# EAGLE design osbwifi20 (EAGLE 7.7.0)
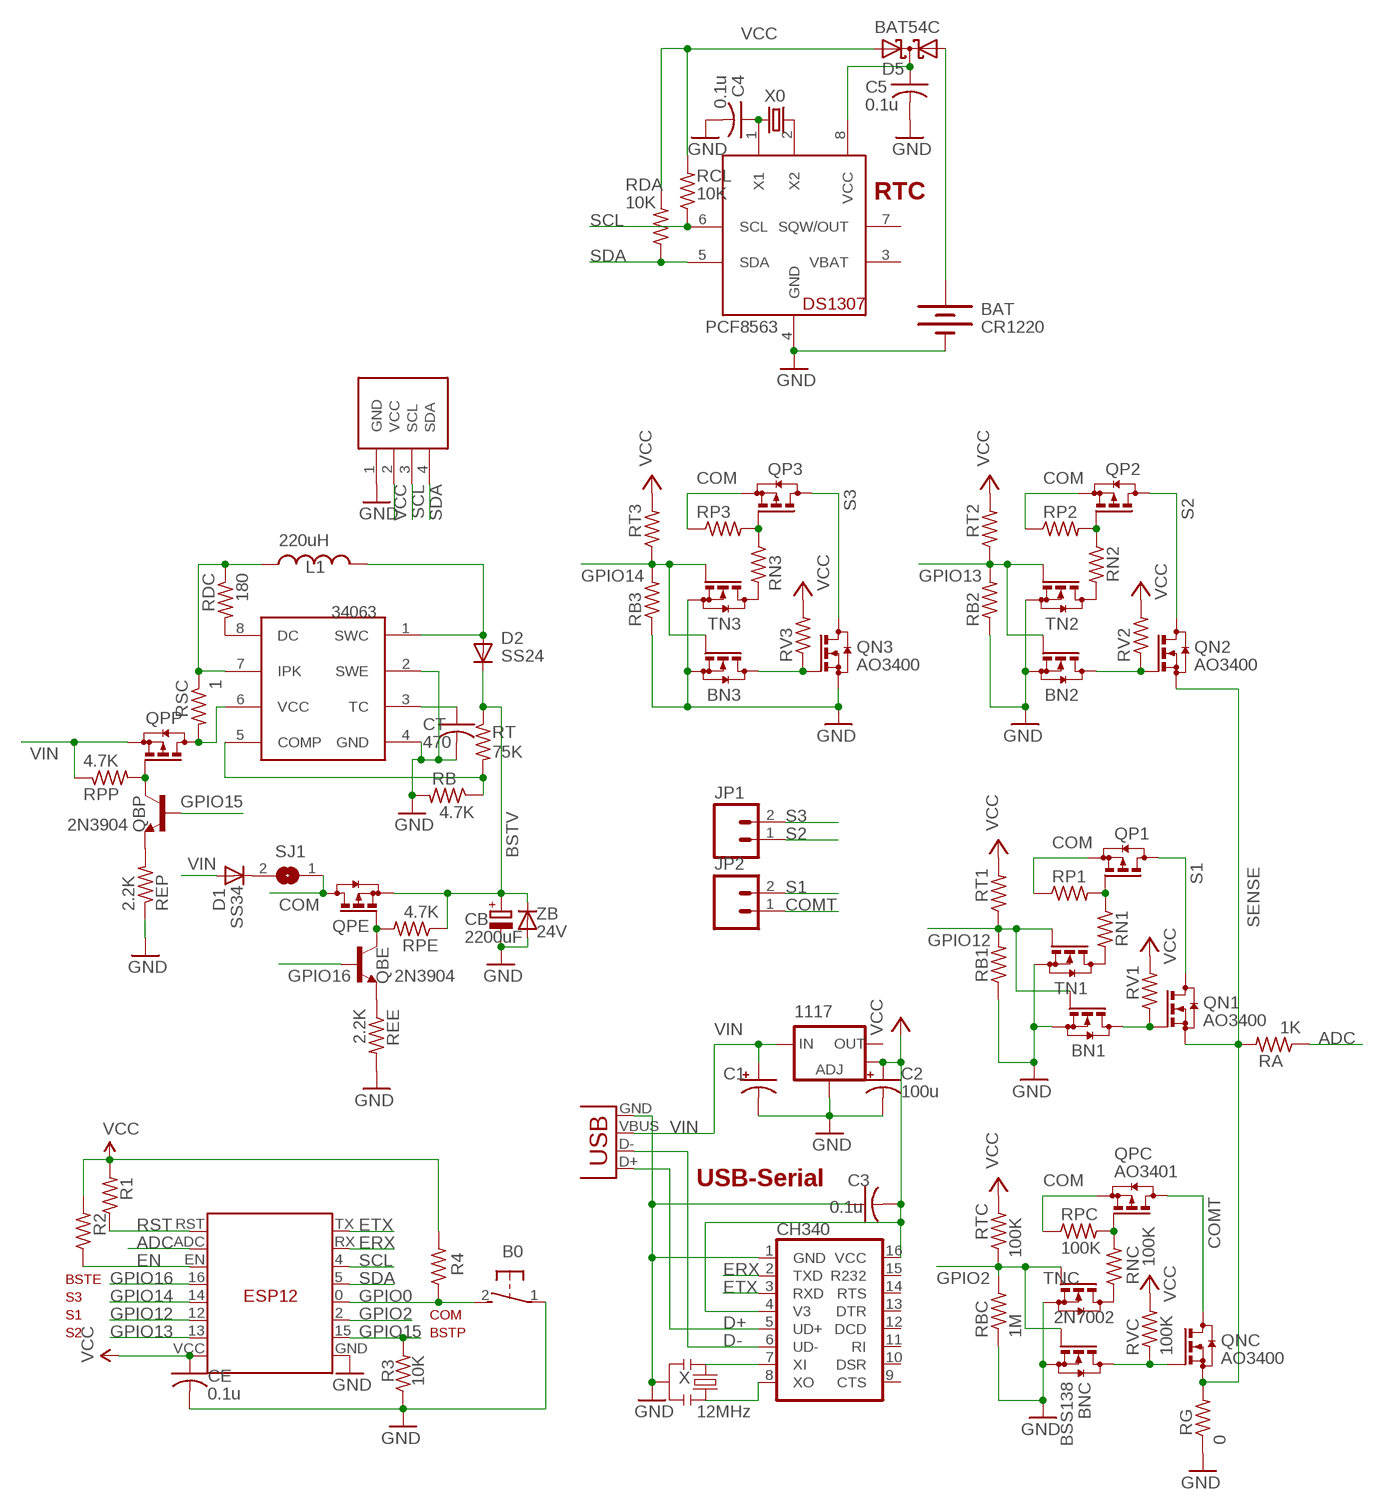
[diagram p0: schematic, sheet 1]

## Parts
1117  1117  V_REG_LM1117SOT223  [SOT223]
34063  MC33063/MC34063D  [SO08]
B0  31-XX  [B3F-31XX]
BAT  CR1220  BATTERYBATTERY_12MM_SMT  [BATTCON_12MM_SMT]
BN1  BSS138  BSS123  [SOT23]
BN2  BSS138  BSS123  [SOT23]
BN3  BSS138  BSS123  [SOT23]
BNC  BSS138  BSS123  [SOT23]
C1  100u  CPOL-USB/3528-21R  [B/3528-21R]
C2  100u  CPOL-USB/3528-21R  [B/3528-21R]
C3  0.1u  C-USC0603  [C0603]
C4  0.1u  C-USC0603  [C0603]
C5  0.1u  C-USC0603  [C0603]
CB  2200uF  CPOL-EUE5-8.5  [E5-8,5]
CE  0.1u  C-USC0603  [C0603]
CH340  CH340G  [SO16]
CT  470  C-USC0603K  [C0603K]
D1  SS34  DIODE-SMB  [SMB]
D2  SS24  DIODE-DO-214AC  [DO-214AC]
D5  BAT54C  [SOT23]
ESP  ESP  ESP12  [ESP12]
JP1  M025MM  [SCREWTERMINAL-5MM-2]
JP2  M025MM  [SCREWTERMINAL-5MM-2]
L1  220uH  INDUCTORCR54  [CR54]
PCF8563  PCF8563  DS1307SOIC  [SO08]
QBE  2N3904  TRANSISTOR_NPNSOT23-3  [SOT23-3]
QBP  2N3904  TRANSISTOR_NPNSOT23-3  [SOT23-3]
QN1  AO3400  BSS123  [SOT23]
QN2  AO3400  BSS123  [SOT23]
QN3  AO3400  BSS123  [SOT23]
QNC  AO3400  BSS123  [SOT23]
QP1  AO3407  BSS84  [SOT23]
QP2  AO3407  BSS84  [SOT23]
QP3  AO3407  BSS84  [SOT23]
QPC  AO3401  BSS84  [SOT23]
QPE  AO3401  BSS84  [SOT23]
QPP  AO3401  BSS84  [SOT23]
R1  10K  R-US_R0603  [R0603]
R2  10K  R-US_R0603  [R0603]
R3  10K  R-US_R0603  [R0603]
R4  10K  R-US_R0603  [R0603]
RA  1K  R-US_R0603  [R0603]
RB  4.7K  R-US_R0603  [R0603]
RB1  1M  R-US_R0603  [R0603]
RB2  1M  R-US_R0603  [R0603]
RB3  1M  R-US_R0603  [R0603]
RBC  1M  R-US_R0603  [R0603]
RCL  10K  R-US_R0603  [R0603]
RDA  10K  R-US_R0603  [R0603]
RDC  180  R-US_R0603  [R0603]
REE  2.2K  R-US_R0603  [R0603]
REP  2.2K  R-US_R0603  [R0603]
RG  0  R-US_R2512  [R2512]
RN1  100K  R-US_R0603  [R0603]
RN2  100K  R-US_R0603  [R0603]
RN3  100K  R-US_R0603  [R0603]
RNC  100K  R-US_R0603  [R0603]
RP1  100K  R-US_R0603  [R0603]
RP2  100K  R-US_R0603  [R0603]
RP3  100K  R-US_R0603  [R0603]
RPC  100K  R-US_R0603  [R0603]
RPE  4.7K  R-US_R0603  [R0603]
RPP  4.7K  R-US_R0603  [R0603]
RSC  1  R-US_R0603  [R0603]
RT  75K  R-US_R0603  [R0603]
RT1  100K  R-US_R0603  [R0603]
RT2  100K  R-US_R0603  [R0603]
RT3  100K  R-US_R0603  [R0603]
RTC  100K  R-US_R0603  [R0603]
RV1  100K  R-US_R0603  [R0603]
RV2  100K  R-US_R0603  [R0603]
RV3  100K  R-US_R0603  [R0603]
RVC  100K  R-US_R0603  [R0603]
SJ1  SJ  [SJ]
TN1  7002  BSS123  [SOT23]
TN2  7002  BSS123  [SOT23]
TN3  7002  BSS123  [SOT23]
TNC  2N7002  BSS123  [SOT23]
U$1  SSD1306_OLED_I2C  [SSD1306_OLED_I2C]
USB  USBSMD  [USB-MINIB]
X  12MHz  RESONATORSMD  [RESONATOR-SMD]
X0  32.768kHz  CRYSTALMM20SS1  [MM20SS1]
ZB  24V  DIODE-MINIMELF  [MINIMELF]

## Nets
ADC: ESP.ADC RA.1
BSTV [relaypower]: CB.+ D2.C QPE.2(S) RPE.1 RT.1 ZB.C
COM [relaypower]: QP1.2(S) QP2.2(S) QP3.2(S) QPC.2(S) QPE.3(D) RP1.1 RP2.1 RP3.1 RPC.1 SJ1.1
COMT [relaypower]: JP2.1 QNC.3(D) QPC.3(D)
D+: CH340.5(UD+) USB.D+
D-: CH340.6(UD-) USB.D-
EN: ESP.EN R2.1
ERX: CH340.2(TXD) ESP.RX
ETX: CH340.3(RXD) ESP.TX
GND: 1117.1(ADJ) 34063.2(SWE) 34063.4(GND) B0.1(P) BAT.P$1(-) BN1.2(S) BN2.2(S) BN3.2(S) BNC.2(S) C1.- C2.- C3.1 C4.2 C5.2 CB.- CE.2 CH340.1(GND) CT.2 ESP.GND PCF8563.4(GND) QN3.2(S) R3.1 RB1.1 RB2.1 RB3.1 RB.2 RBC.1 REE.2 REP.1 RG.1 TN1.2(S) TN2.2(S) TN3.2(S) TNC.2(S) U$1.1(GND) USB.GND X.2 ZB.A
GPIO0: B0.2(S) ESP.0(G0) R4.1
GPIO2: BNC.1(G) ESP.2(G2) RBC.2 RTC.1 TNC.1(G)
GPIO12: BN1.1(G) ESP.12(G12) RB1.2 RT1.1 TN1.1(G)
GPIO13: BN2.1(G) ESP.13(G13) RB2.2 RT2.1 TN2.1(G)
GPIO14: BN3.1(G) ESP.14(G14) RB3.2 RT3.1 TN3.1(G)
GPIO15: ESP.15(G15) QBP.1(B) R3.2
GPIO16: ESP.16(G16) QBE.1(B)
N$1: QPC.1(G) RNC.2 RPC.2
N$2: QBP.3(C) QPP.1(G) RPP.2
N$3: RNC.1 TNC.3(D)
N$4: RN1.2 TN1.3(D)
N$5: BNC.3(D) QNC.1(G) RVC.1
N$6: CH340.7(XI) X.1
N$7: QP1.1(G) RN1.1 RP1.2
N$8: RN3.2 TN3.3(D)
N$9 [relaypower]: 34063.1(SWC) D2.A L1.P$2
N$10: D1.C SJ1.2
N$11: BN1.3(D) QN1.1(G) RV1.1
N$12: QP2.1(G) RN2.1 RP2.2
N$13: RN2.2 TN2.3(D)
N$14: C4.1 PCF8563.1(X1) X0.1
N$15: BN2.3(D) QN2.1(G) RV2.1
N$16: QP3.1(G) RN3.1 RP3.2
N$17: BAT.P$2(+) D5.1(A1)
N$19: BN3.3(D) QN3.1(G) RV3.1
N$21: QBE.2(E) REE.1
N$26 [relaypower]: 34063.7(IPK) L1.P$1 RDC.1 RSC.1
N$27 [power]: 34063.6(VCC) QPP.3(D) RSC.2
N$28: 34063.3(TC) CT.1
N$29: 34063.5(COMP) RB.1 RT.2
N$30: PCF8563.2(X2) X0.4
N$31: 34063.8(DC) RDC.2
N$32: QBP.2(E) REP.2
N$38: QBE.3(C) QPE.1(G) RPE.2
N$40: CH340.8(XO) X.3
N$51: C5.1 D5.3(CC) PCF8563.8(VCC)
RST: ESP.RST R1.1
S1 [relaypower]: JP2.2 QN1.3(D) QP1.3(D)
S2 [relaypower]: JP1.1 QN2.3(D) QP2.3(D)
S3 [relaypower]: JP1.2 QN3.3(D) QP3.3(D)
SCL: ESP.4(G4) PCF8563.6(SCL) RCL.1 U$1.3(SCL)
SDA: ESP.5(G5) PCF8563.5(SDA) RDA.1 U$1.4(SDA)
SENSE [relaypower]: QN1.2(S) QN2.2(S) QNC.2(S) RA.2 RG.2
VCC: 1117.4(OUT) C2.+ C3.2 CE.1 CH340.4(V3) CH340.16(VCC) D5.2(A2) ESP.VCC R1.2 R2.2 R4.2 RCL.2 RDA.2 RT1.2 RT2.2 RT3.2 RTC.2 RV1.2 RV2.2 RV3.2 RVC.2 U$1.2(VCC)
VIN [power]: 1117.3(IN) C1.+ D1.A QPP.2(S) RPP.1 USB.VBUS
Unconnected: 1117.2(OUT) CH340.9(CTS) CH340.10(DSR) CH340.11(RI) CH340.12(DCD) CH340.13(DTR) CH340.14(RTS) CH340.15(R232) PCF8563.7(SQW/OUT)

## Notes on the sheet
- RTC
- USB-Serial
- BSTE
- S3
- S1 | COM
- S2 | BSTP

## Power pins joined to a net without a drawn wire
VBAT: PCF8563.3(VBAT)

## Library data of the parts
1117 = SparkFun:V_REG_LM1117: Voltage Regulator LM1117 Standard adjustable voltage regulator but in SMD form. Spark Fun Electronics SKU : COM-00595
34063 = adafruit:MC33063/MC34063: MC33063 and MC34063 Basic DC/DC converter with internal power-NPN transistor, 100KHz, 1.5A peak switch current. 3-40 input/output.
B0 = switch-omron:31-XX: OMRON SWITCH; MPN: B3F-3100; OC_FARNELL: 959704; OC_NEWARK: 36M3582
BAT = SparkFunNew:BATTERY: Battery Holders Various common sizes : AA, AAA, 20mm coin cell and 12mm coin cell.
BN1-BN3 BNC QN1-QN3 QNC TN1-TN3 TNC = transistor-small-signal:BSS123: N-CHANNEL MOS FET
C1 C2 = adafruit_3:CPOL-US: POLARIZED CAPACITOR, American symbol
C3-C5 CE CT = adafruit:C-US: CAPACITOR, American symbol
CB = rcl:CPOL-EU: POLARIZED CAPACITOR, European symbol
CH340 = SparkFunNew:CH340
D1 D2 ZB = diode:DIODE-: DIODE
D5 = diode:BAT54C: Schottky Diodes Source: Fairchild .. BAT54.pdf
ESP = JeeParts:ESP12
JP1 JP2 = SparkFun:M02: Header 2 Standard 2-pin 0.1" header. Use with straight break away headers (SKU : PRT-00116), right angle break away headers (PRT-00553), swiss pins (PRT-00743), machine pins (PRT-00117), and female headers (PRT-00115). Molex polarized connector foot print use with SKU : PRT-08233 with associated crimp pins and housings.
L1 = SparkFunNew:INDUCTOR: Inductors Basic Inductor/Choke - 0603 and 1206. Footprints are not proven and vary greatly between part numbers.
PCF8563 = adafruit:DS1307: DS1307 Real time clock (RTC) with battery backup ability. Talk to it via i2c
QBE QBP = SparkFunNew:TRANSISTOR_NPN: Transistor NPN BJT configuration in SOT23 package. MMBT2222 is the common NPN we use. Double check BCE configuration again layout.
QP1-QP3 QPC QPE QPP = transistor-small-signal:BSS84: P-CHANNEL MOS FET
R1 R2 R4 = adafruit:R-US_: RESISTOR, American symbol
R3 RCL RDA RG = adafruit2013:R-US_: RESISTOR, American symbol
RA RB RB1-RB3 RBC RDC REE REP RN1-RN3 RNC RP1-RP3 RPC RPE RPP RSC RT RT1-RT3 RTC RV1-RV3 RVC = adafruitGood:R-US_: RESISTOR, American symbol
SJ1 = jumper:SJ: SMD solder JUMPER
U$1 = adafruit2013:SSD1306_OLED_I2C
USB = SparkFunNew:USB: USB Connectors USB-B-PTH is fully proven SKU : PRT-00139 USB-miniB is fully proven SKU : PRT-00587 USB-A-PCB is untested. USB-A-H is throughly reviewed, but untested. Spark Fun Electronics SKU : PRT-00437 USB-B-SMT is throughly reviewed, but untested. Needs silkscreen touching up. USB-A-S has not been used/tested USB-MB-H has not been used/tested
X = SparkFunNew:RESONATOR: Resonator Small SMD resonator. This is the itty bitty 10/20MHz resonators with built in caps. CSTCE10M0G55 and CSTCE20M0V53. Footprint has been reviewed closely but hasn't been tested yet.
X0 = crystal:CRYSTAL: CRYSTAL

## Net classes
0 default: width 0.203 mm, clearance 0.178 mm
1 power: width 0.305 mm, clearance 0.178 mm
2 relaypower: width 0.508 mm, clearance 0.305 mm

## Board
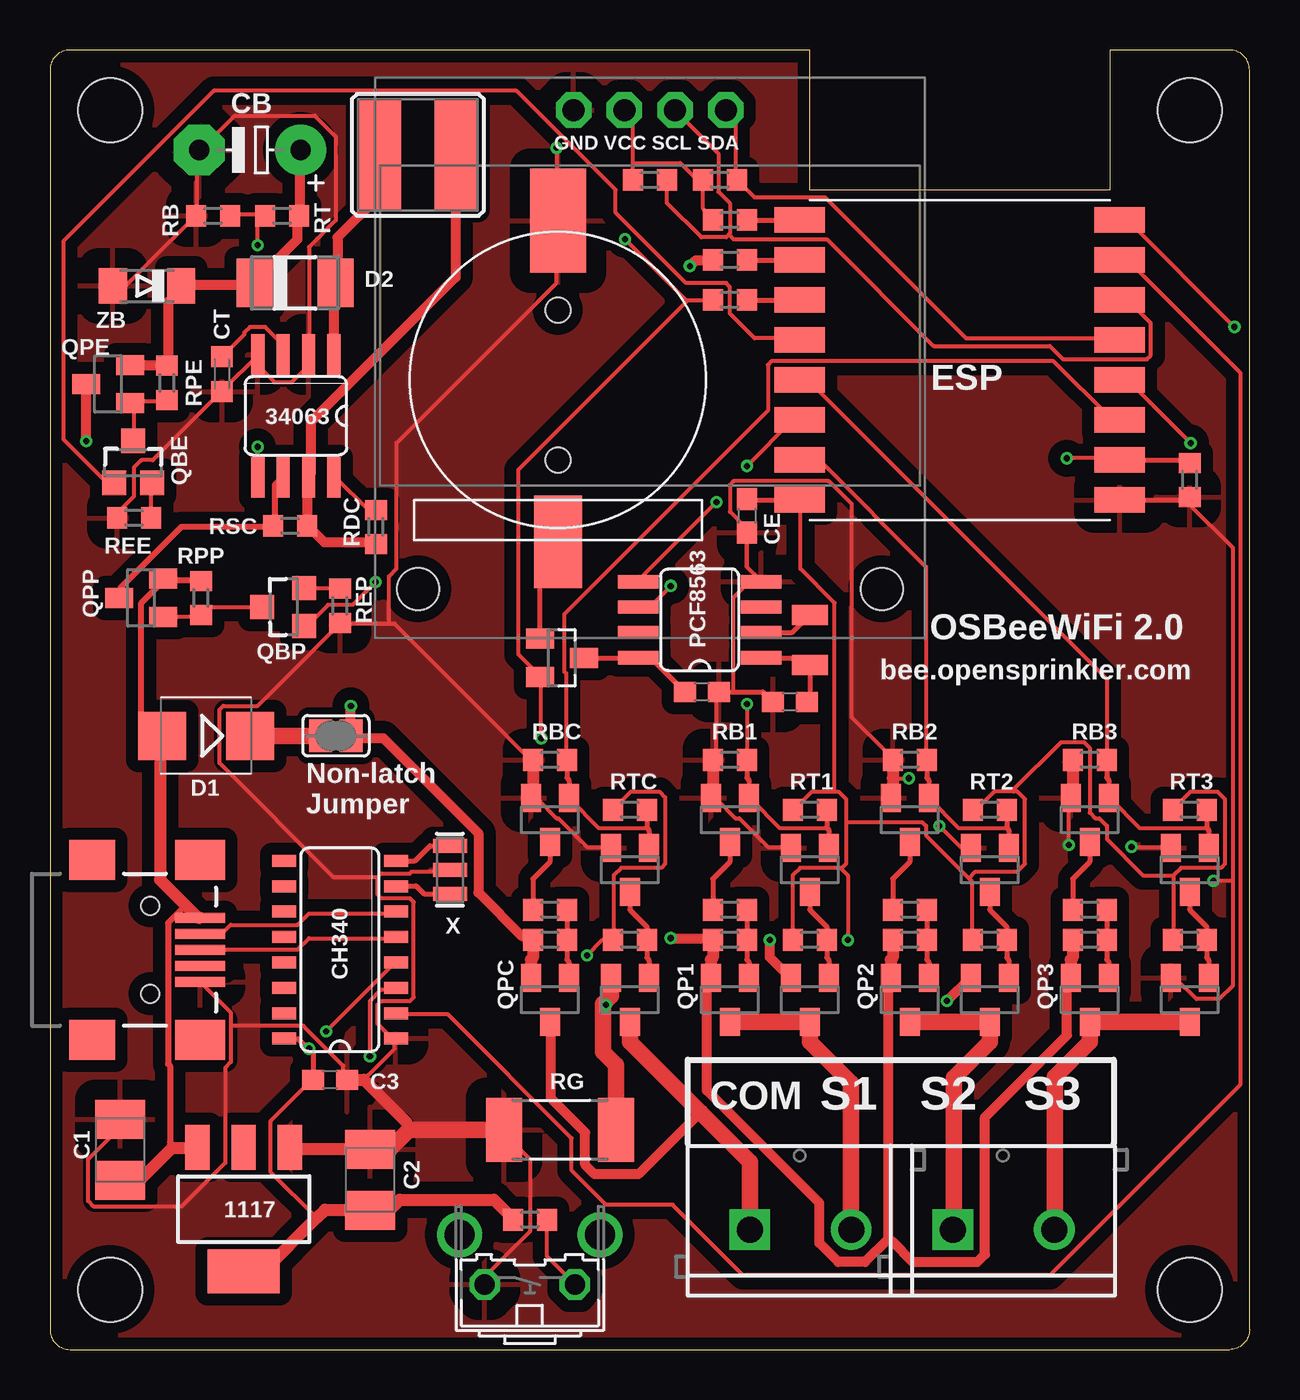
[diagram p1: board, top side]
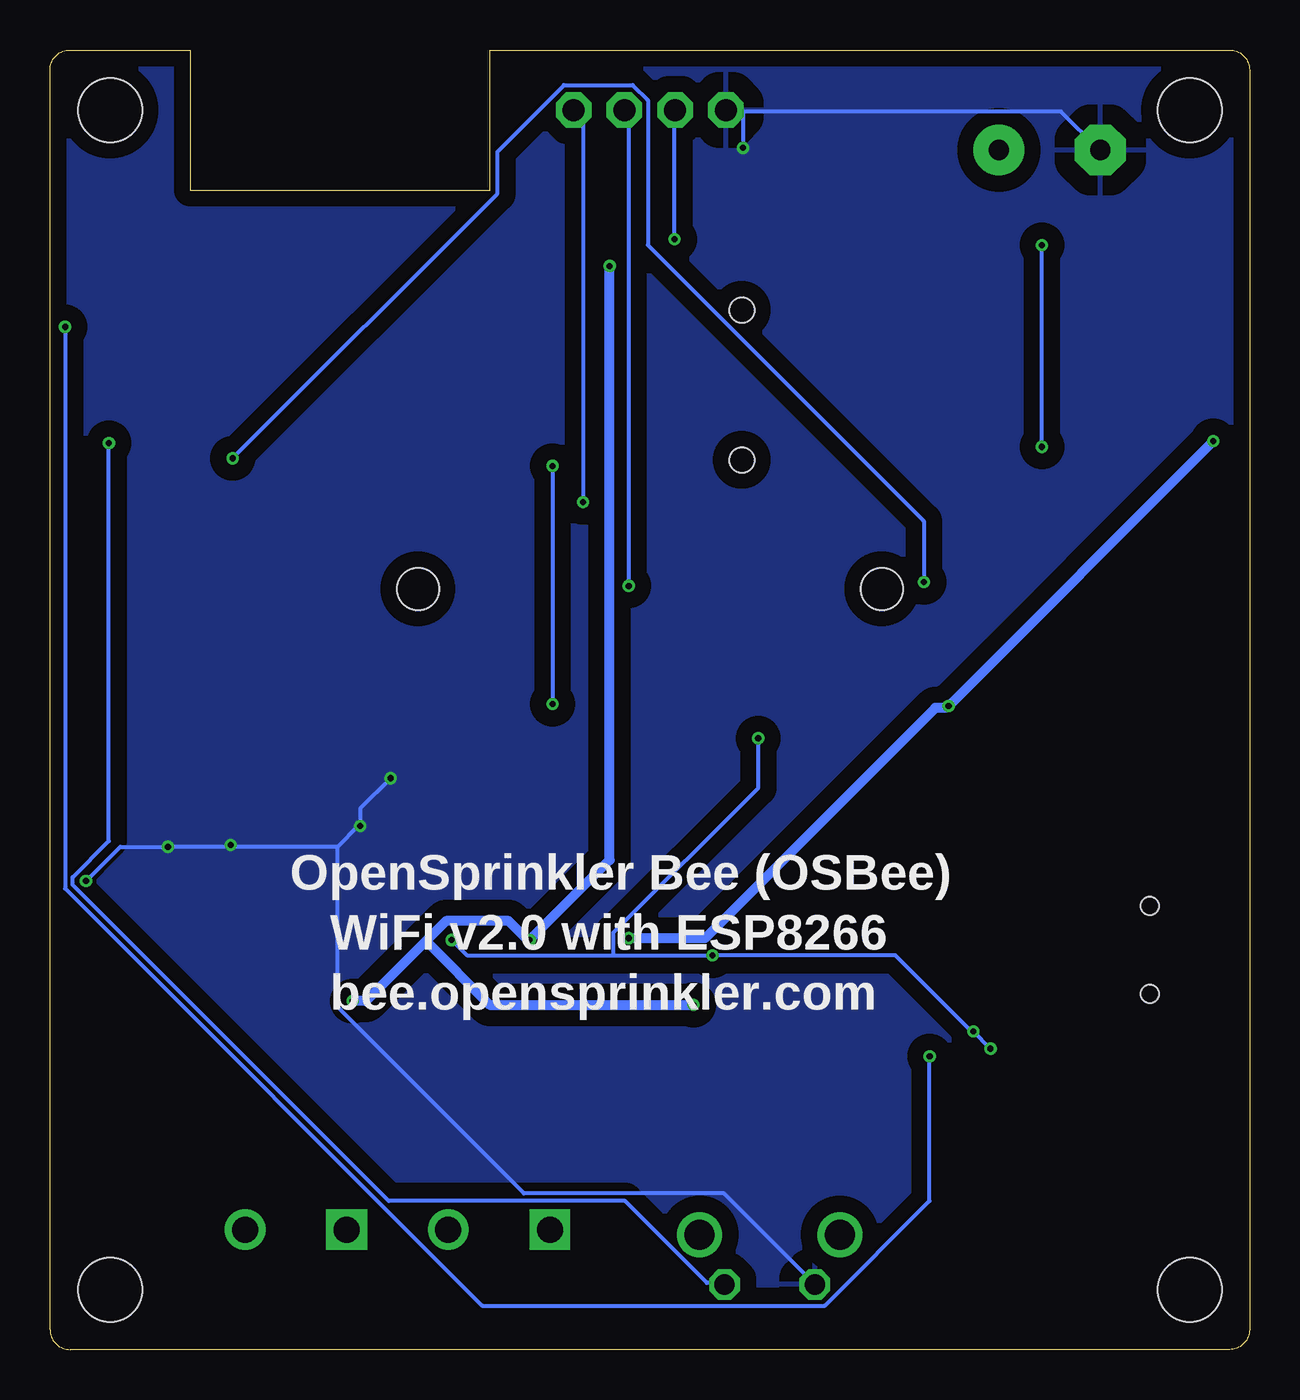
[diagram p2: board, bottom side, seen from below]

Size 60 x 65 mm. Coordinates in mm from the lower left corner, seen from the top.
Outline: 1,0 59,0 arc90 60,1 60,64 arc90 59,65 53,65 53,58 38,58 38,65 1,65 arc90 0,64 0,1 arc90 1,0
Copper layers (1*16): Top 0.035mm / dielectric 1.5mm / Bottom 0.035mm
Design rules "Fusion_eagle_rule_v1.1 *": minimum track width 6mil, minimum drill 12mil, track to track 6mil, track to pad 6mil, pad to pad 6mil, via to via 6mil, smd to smd 0mil, copper to edge 10mil, drill to drill 10mil, minimum pad ring 10mil, minimum via ring 6mil, stop-mask expansion 2mil, vias tented up to drill 100mil, thermal gap 40mil
Holes 3.2 mm at 3,3 57,3 3,62 57,62
bRestrict: area 4,17 to 9,23

### Footprints (pad centres in the part's own frame; a part is rotated, then mirrored left to right if it is on the bottom)
SOT223 = smd 1.219 x 2.235: 1 -2.311,-3.099; 2 0,-3.099; 3 2.311,-3.099 | smd 3.6 x 2.2: 4 0,3.099
SO08 = smd 0.66 x 2.032: 1 -1.905,-3.073; 2 -0.635,-3.073; 3 0.635,-3.073; 4 1.905,-3.073; 5 1.905,3.073; 6 0.635,3.073; 7 -0.635,3.073; 8 -1.905,3.073
B3F-31XX = drill 1.016 octagon: 1 -2.261,-1.245; 2 2.261,-1.245 | drill 1.499 pad 2.159: 3 -3.505,1.245; 4 3.505,1.245
BATTCON_12MM_SMT = smd 2.8 x 5.2: P$1 0,11.96 | smd 2.4 x 4.6: P$2 0,-4.1 | hole 1.25: 0,7.5; 0,0
SOT23 = smd 1 x 1.4: 1 -0.95,-1.1; 2 0.95,-1.1; 3 0,1.1
B/3528-21R = smd 1.95 x 2.5: + 1.525,0; - -1.525,0
C0603 = smd 1.1 x 1: 1 -0.85,0; 2 0.85,0
E5-8,5 = drill 1.016 pad 2.54: + -2.54,0 | drill 1.016 pad 2.54 octagon: - 2.54,0
SO16 = smd 0.6 x 1.2: 1 -4.445,-2.8; 2 -3.175,-2.8; 3 -1.905,-2.8; 4 -0.635,-2.8; 5 0.635,-2.8; 6 1.905,-2.8; 7 3.175,-2.8; 8 4.445,-2.8; 9 4.445,2.8; 10 3.175,2.8; 11 1.905,2.8; 12 0.635,2.8; 13 -0.635,2.8; 14 -1.905,2.8; 15 -3.175,2.8; 16 -4.445,2.8
C0603K = smd 1.05 x 1.08: 1 -0.875,0; 2 0.875,0
SMB = smd 2.4 x 2.4: A 2.2,0; C -2.2,0
DO-214AC = smd 1.8 x 2.4: A 2.025,0; C -2.025,0
ESP12 = smd 2.54 x 1.27: 0 8,-2; 2 8,-4; 4 8,2; 5 8,0; 12 -8,-4; 13 -8,-6; 14 -8,-2; 15 8,-6; 16 -8,0; ADC -8,4; EN -8,2; GND 8,-8; RST -8,6; RX 8,4; TX 8,6; VCC -8,-8
SCREWTERMINAL-5MM-2 = drill 1.3 pad 2.032 square: 1 0,0 | drill 1.3 pad 2.032: 2 5.08,0
CR54 = smd 5.5 x 2.15: P$1 0,1.92; P$2 0,-1.92
SOT23-3 = smd 1.2 x 1.2: 1 -0.95,-1; 2 0.95,-1; 3 0,1.1
R0603 = smd 1 x 1.1: 1 -0.85,0; 2 0.85,0
R2512 = smd 1.8 x 3.2: 1 -2.8,0; 2 2.8,0
SJ = smd 1.168 x 1.6: 1 -0.762,0; 2 0.762,0
SSD1306_OLED_I2C = drill 1.1 pad 1.778 octagon: 1 -3.81,0; 2 -1.27,0; 3 1.27,0; 4 3.81,0 | hole 2.1: 11.6,-23.95; -11.6,-23.95
USB-MINIB = smd 2.5 x 0.5: D+ 2.5,0; D- 2.5,0.8; GND 2.5,-1.6; ID 2.5,-0.8; VBUS 2.5,1.6 | smd 2.3 x 2: MTN1 -2.9,4.5; MTN3 -2.9,-4.5 | smd 2.5 x 2: MTN2 2.5,4.5; MTN4 2.5,-4.5 | hole 0.9: 0,2.2; 0,-2.2
RESONATOR-SMD = smd 0.7 x 1.7: 1 -1.2,0; 2 0,0; 3 1.2,0
MM20SS1 = smd 1.8 x 1: 1 0,-1.25; 4 0,1.25
MINIMELF = smd 1.4 x 1.8: A 1.7,0; C -1.7,0

### Placement (x,y rotation side)
1117  9.69,7.01 180 top
34063  12.3,46.7 180 top
B0  24,4.5 0 top
BAT  25.4,44.5 0 top
BN1  38,24 180 top
BN2  47,24 180 top
BN3  57,24 180 top
BNC  29,24 180 top
C1  3.5,10 270 top
C2  16,8.5 270 top
C3  14,13.5 180 top
C4  37,32.4 180 top
C5  32.6,32.9 0 top
CB  10,60 180 top
CE  34.85,41.7 270 top
CH340  14.5,20 90 top
CT  8.6,48.8 270 top
D1  7.8,30.7 180 top
D2  12.25,53.35 0 top
D5  25.6,34.6 270 top
ESP  45.5,50.5 0 top
JP1  45.16,6 0 top
JP2  35,6 0 top
L1  18.4,59.75 270 top
PCF8563  32.5,36.5 90 top
QBE  4.15,44.35 0 top
QBP  11.7,37.15 90 top
QN1  38,17.5 180 top
QN2  47,17.5 180 top
QN3  57,17.5 180 top
QNC  29,17.5 180 top
QP1  34,17.5 180 top
QP2  43,17.5 180 top
QP3  52,17.5 180 top
QPC  25,17.5 180 top
QPE  2.9,48.3 90 top
QPP  4.55,37.6 90 top
R1  34,56.5 180 top
R2  34,52.5 180 top
R3  57,43.5 90 top
R4  24,6.5 180 top
RA  34,54.5 180 top
RB  8.15,56.7 180 top
RB1  34,29.5 0 top
RB2  43,29.5 0 top
RB3  52,29.5 0 top
RBC  25,29.5 0 top
RCL  30,58.5 180 top
RDA  33.5,58.5 180 top
RDC  16.3,41.15 90 top
REE  4.2,41.6 180 top
REP  14.5,37.2 90 top
RG  25.5,11 0 top
RN1  34,22 180 top
RN2  43,22 180 top
RN3  52,22 180 top
RNC  25,22 0 top
RP1  34,20.5 0 top
RP2  43,20.5 0 top
RP3  52,20.5 0 top
RPC  25,20.5 0 top
RPE  5.85,48.35 270 top
RPP  7.55,37.6 270 top
RSC  12,41.2 180 top
RT  11.6,56.7 180 top
RT1  38,27 180 top
RT2  47,27 180 top
RT3  57,27 180 top
RTC  29,27 180 top
RV1  38,20.5 180 top
RV2  47,20.5 180 top
RV3  57,20.5 180 top
RVC  29,20.5 180 top
SJ1  14.3,30.7 180 top
TN1  34,26.5 180 top
TN2  43,26.5 180 top
TN3  52,26.5 180 top
TNC  25,26.5 180 top
U$1  30,62 0 top
USB  5,20 0 top
X  20,24 90 top
X0  38,35.5 0 top
ZB  4.85,53.2 180 top

### Tracks (layer width: path | path; a pad name or v marks a point on that pad's centre or on a via)
ADC
  Top 0.254: ESP.ADC 35,54.5 34.9,54.6 34.8,54.5 RA.1
BSTV
  Top 0.508: CB.+ 12.48,59.91 12.48,56.77 RT.1 12.38,56.48 12.38,55.53 10.38,53.53 D2.C 10.19,53.34 10.1,53.24 6.57,53.24 ZB.C 6.48,52.96 5.91,52.39 5.91,49.44 RPE.1 5.81,49.24 QPE.2
COM  (via drill 0.3)
  Top 0.508: 41.91,5.52 40.77,4.38 39.43,4.38 38.48,5.33 38.48,7.33 32.86,12.95 32.86,18.38 QP1.2 | 41.91,5.52 41.91,18.38 QP2.2 | QP3.2 50.86,18.38 50.86,15.72 46.77,11.62 46.77,4.76 46.39,4.38 43.15,4.38 42.1,5.43 41.91,5.52 | v1.81,45.43 QPE.3 | v15.05,32.19 15.05,30.77 SJ1.1 15.24,30.57 16.67,30.57 21.43,25.81 21.43,22.86 23.62,20.67 23.91,20.67 RPC.1 | v31.05,20.57 32.86,20.57 RP1.1
  Top 0.61: QPC.2 24.05,19.5 24.15,19.6 RPC.1 | QP1.2 33.05,19.5 33.15,19.6 RP1.1 | QP2.2 42.05,19.5 42.15,19.6 RP2.1 | QP3.2 51.05,19.5 51.15,19.6 RP3.1
  Bottom 0.508: v1.81,45.43 v15.05,32.19 15.24,32.1 15.72,32.1 27.24,20.57 v31.05,20.57
COMT
  Top 0.508: 32.53,11.87 29.43,8.76 27.24,8.76 26.77,9.24 26.77,10.86 25.05,12.57 25.05,16.38 QPC.3
  Top 0.813: JP2.1 35,9.4 32.53,11.87 29,15.4 QNC.3
D+
  Top 0.203: CH340.5 17.24,20.57 12.95,20.57 12.38,20 7.53,20 USB.D+
D-
  Top 0.203: CH340.6 17.24,21.81 12.95,21.81 12.38,21.24 9.05,21.24 8.67,20.86 7.53,20.86 USB.D-
EN
  Top 0.254: ESP.EN 35,52.5 34.9,52.6 34.8,52.5 R2.1
ERX
  Top 0.203: CH340.2 17.34,16.76 19.91,16.76 26.1,10.57 26.1,8.95 27.81,7.24 31.15,7.24 34.67,3.71 50.01,3.71 59.53,13.24 59.53,48.86 53.91,54.48 53.53,54.48 ESP.RX
ETX  (via drill 0.3)
  Top 0.203: v16,14.67 16,17.43 16.57,18 17.24,18 CH340.3 | v59.24,51.15 53.91,56.48 53.53,56.48 ESP.TX
  Bottom 0.203: v16,14.67 16,7.43 21.24,2.19 38.39,2.19 59.24,23.05 v59.24,51.15
GND  (via drill 0.3)
  Top 0.203: BN1.2 36.96,25.15 35.91,25.15 34.48,26.57 34.29,26.57 33.34,27.53 TN1.2 | C5.2 33.34,32.86 33.34,29.72 RB1.1 | 34.2,32.9 34.2,37.62 35.24,38.67 PCF8563.4 35.53,38.48 34.86,39.15 34.86,40.77 CE.2 34.77,40.86 34.77,41.15 34,41.91 34,43.24 34.2,43.43 38.96,43.43 40.1,42.29 40.1,31.62 42.01,29.72 RB2.1 | v44.48,26.19 45.53,25.15 46.01,25.15 BN2.2 | 42.15,28.57 v42.96,28.57 | v54.1,25.15 56.01,25.15 BN3.2 | v50.96,25.24 50.96,27.34 TN3.2 | 59.15,23.43 59.15,40.1 56.86,42.39 R3.1 | 59.15,23.43 59.15,18.19 58.48,17.53 57.34,17.53 56.29,18.57 56.1,18.57 QN3.2 | 59.15,23.43 v58.2,23.43 | REE.2 3.43,41.62 3.43,41.91 4.19,42.67 4.19,44.1 4.57,44.48 5.14,44.48 8.57,47.91 CT.2 8.67,48.01 10.38,49.72 34063.4 10.19,49.44 11.24,48.39 12.1,48.39 12.86,49.15 12.86,49.72 34063.2 12.95,49.82 12.95,55.15 14.29,56.48 14.29,60.67 13.24,61.72 9.24,61.72 7.53,60.01 CB.- 7.43,59.91 7.33,59.82 7.33,56.77 RB.2 7.24,56.67 3.81,53.24 3.24,53.24 ZB.A | v25.34,60.1 25.34,56.48 BAT.P$1 25.34,56.39 25.34,53.34 17.34,45.34 17.34,39.05 16.95,38.67 16.95,36.29 | 16.95,36.29 17.24,36.29 23.91,29.62 RBC.1 | 16.95,36.29 14.57,36.29 REP.1 14.48,36.29 10.38,32.19 8.67,32.19 8.48,32 8.48,29.34 14.19,23.62 16.38,23.62 | BNC.2 28,25.15 26.86,25.15 25.43,26.57 25.34,26.57 24.38,27.53 TNC.2 | 9.05,16.19 9.05,16.86 7.53,18.38 USB.GND | 9.05,16.19 9.05,14.38 8.76,14.1 8.76,9.34 6.57,7.14 2.19,7.14 1.91,7.43 1.91,9.53 3.43,11.05 3.43,11.43 C1.- | 17.34,15.62 CH340.1 | CH340.1 17.24,15.53 17.24,15.05 15.91,13.72 15.7,13.5 | 16.38,23.62 16.57,23.81 18,23.81 18.1,23.91 19.91,23.91 X.2
  Top 0.203: 16.38,23.62 16.38,22.77 16.57,22.57 18,22.57 18.19,22.38 18.19,17.62 18,17.43 16.57,17.43 16.38,17.24 16.38,16.29 17.14,15.53 CH340.1 | B0.1 21.81,3.33 21.81,3.71 24,5.91 24,9.53 22.86,10.67 RG.1 | 9.05,16.19 12.67,16.19 14.67,14.19 14.67,13.72 C3.1
  Top 0.254: ESP.GND 56.85,42.5 R3.1 | C5.2 34.2,32.9 35.65,32.9 C4.2
  Top 0.61: RBC.1 24.15,27.7 TNC.2 | RB1.1 33.15,27.7 TN1.2 | RB2.1 42.15,28.57 42.15,27.7 TN2.2 | RB3.1 51.15,27.7 TN3.2 | C2.- 16,10.05 12,10.05 1117.1 | C3.1 15.7,13.5 17.8,11.4 17.95,11
  Top 0.813: RG.1 17.95,11 17,10.05 16.3,10.05 C2.-
  Bottom 0.203: v42.96,28.57 44.48,27.05 v44.48,26.19 44.58,26.19 45.62,25.15 | 45.62,25.15 50.96,25.15 | 50.96,25.15 v54.1,25.15 56.48,25.15 v58.2,23.43 | v50.96,25.24 50.96,25.15 | CB.- 7.53,60.01 9.43,61.91 26.1,61.91 U$1.1 25.34,61.82 v25.34,60.1 | 45.62,25.15 45.62,17.14 36.29,7.81 26.29,7.81 21.81,3.33 B0.1
  pour Top (isolate 0.61): 0,65 60,65 60,0 0,0
  pour Bottom (isolate 0.813): 0,65 60,65 60,0 0,0
GPIO0  (via drill 0.3)
  Top 0.203: R4.1 24.86,6.48 24.86,4.67 26.19,3.33 B0.2 | v57.05,45.34 53.91,48.48 53.53,48.48 ESP.0
  Bottom 0.203: v57.05,45.34 57.05,25.43 58.86,23.62 58.86,23.24 43.05,7.43 31.24,7.43 27.15,3.33 26.29,3.33 B0.2
GPIO2
  Top 0.203: 29.85,26.1 29.81,26.1 27.43,26.1 26,27.53 TNC.1 | RBC.2 25.81,29.62 25.81,33.81 25.72,33.91 25.72,36.77 35.91,46.96 35.91,49.24 36.1,49.44 50.2,49.44 53.05,46.58 53.44,46.58 ESP.2
  Top 0.254: BNC.1 29.95,26 29.85,26.1 RTC.1 | TNC.1 25.95,28.5 25.85,28.6 RBC.2
GPIO12  (via drill 0.3)
  Top 0.203: 38.85,26.1 38.77,26.1 36.48,26.1 35.05,27.53 TN1.1 | v34.86,32.29 34.86,29.62 RB1.2 | v34.86,44.2 37.15,46.48 37.43,46.48 ESP.12
  Top 0.254: BN1.1 38.95,26 38.85,26.1 RT1.1 | TN1.1 34.95,28.5 34.85,28.6 RB1.2
  Bottom 0.203: v34.86,44.2 v34.86,32.29
GPIO13
  Top 0.203: 47.85,26.1 47.82,26.1 45.43,26.1 44.01,27.53 TN2.1 | RB2.2 43.81,29.62 43.81,39.15 38.48,44.48 37.53,44.48 ESP.13
  Top 0.254: BN2.1 47.95,26 47.85,26.1 RT2.1 | TN2.1 43.95,28.5 43.85,28.6 RB2.2
GPIO14
  Top 0.203: 57.85,26.1 57.82,26.1 54.48,26.1 53.05,27.53 TN3.1 | RB3.2 52.86,29.62 52.86,33.53 37.91,48.48 37.53,48.48 ESP.14
  Top 0.254: BN3.1 57.95,26 57.85,26.1 RT3.1 | TN3.1 52.95,28.5 52.85,28.6 RB3.2
GPIO15  (via drill 0.3)
  Top 0.203: v16.29,38.39 15.14,37.24 13.91,37.24 12.95,36.29 12.76,36.29 QBP.1 | v50.86,44.58 53.44,44.58 ESP.15
  Top 0.254: ESP.15 56.85,44.5 R3.2
  Bottom 0.203: v16.29,38.39 16.29,41.43 30.1,55.24 30.1,62.48 30.86,63.25 34.29,63.25 37.62,59.91 37.62,57.82 v50.86,44.58
GPIO16
  Top 0.203: QBE.1 3.14,43.43 2.76,43.43 0.67,45.53 0.67,55.44 8.19,62.96 23.34,62.96 28.29,58.01 28.29,56.86 31.81,53.34 33.81,53.34 34,53.15 34,51.82 35.24,50.58 37.43,50.58 ESP.16
N$1
  Top 0.254: QPC.1 25.95,19.4 25.85,19.5 RPC.2 RNC.2
N$2
  Top 0.203: 7.62,36.77 RPP.2 | RPP.2 7.53,36.67 5.71,36.67 QPP.1 | QBP.3 10.57,37.15 8.1,37.15 7.71,36.77 RPP.2
N$3
  Top 0.254: RNC.1 24.15,23.55 25,24.4 TNC.3
N$4
  Top 0.254: RN1.2 33.15,23.55 34,24.4 TN1.3
N$5
  Top 0.254: QNC.1 29.95,19.5 29.85,19.6 RVC.1 29.85,21.15 29,22 BNC.3
N$6
  Top 0.254: X.1 18.7,22.8 18.3,23.2 17.3,23.2 CH340.7
N$7
  Top 0.254: RN1.1 RP1.2 34.85,19.5 34.95,19.4 QP1.1
N$8
  Top 0.254: RN3.2 51.15,23.55 52,24.4 TN3.3
N$9
  Top 0.508: 34063.1 14.19,49.82 14.19,53.34 D2.A 14.38,53.53 14.38,55.63 16.48,57.72 16.48,59.72 L1.P$2
N$10
  Top 0.813: D1.C SJ1.2
N$11
  Top 0.254: BN1.3 38,22 38.85,21.15 RV1.1 38.85,19.6 38.95,19.5 QN1.1
N$12
  Top 0.254: RN2.1 RP2.2 43.85,19.5 43.95,19.4 QP2.1
N$13
  Top 0.254: RN2.2 42.15,23.55 43,24.4 TN2.3
N$14
  Top 0.254: PCF8563.1 37.66,34.59 X0.1 38,32.55 C4.1
N$15
  Top 0.254: BN2.3 47,22 47.85,21.15 RV2.1 47.85,19.6 47.95,19.5 QN2.1
N$16
  Top 0.254: RN3.1 RP3.2 52.85,19.5 52.95,19.4 QP3.1
N$17
  Top 0.254: D5.1 24.5,39.5 BAT.P$2
N$19
  Top 0.254: BN3.3 57,22 57.85,21.15 RV3.1 57.85,19.6 57.95,19.5 QN3.1
N$21
  Top 0.203: REE.1 5.05,41.62 5.05,43.34 QBE.2
N$26
  Top 0.508: RDC.1 16.29,40.39 13.72,40.39 13.05,41.05 RSC.1 12.86,41.24 12.86,43.62 34063.7 13.05,43.81 13.05,46.39 20.29,53.63 20.29,59.72 L1.P$1
N$27
  Top 0.305: 34063.6 11.62,43.62 11.24,43.24 11.24,41.24 RSC.2 11.05,41.15 6.57,41.15 3.52,38.1 3.52,37.62 QPP.3
N$28
  Top 0.203: CT.1 8.67,49.72 9.72,50.77 9.72,50.86 10,51.15 10.76,51.15 11.62,50.29 11.62,49.82 34063.3
N$29  (via drill 0.3)
  Top 0.203: RB.1 9.05,56.77 10.67,56.77 RT.2 10.38,56.67 v10.38,55.24 | v10.38,45.15 10.38,43.72 34063.5
  Bottom 0.203: v10.38,45.15 v10.38,55.24
N$30
  Top 0.254: PCF8563.2 37.12,35.87 X0.4
N$31
  Top 0.203: RDC.2 16.29,42.01 15.91,42.01 14.29,43.62 34063.8
N$32
  Top 0.203: QBP.2 14.48,38.1 REP.2
N$38
  Top 0.203: 5.91,47.53 RPE.2 5.81,47.43 4,47.43 QPE.1 4.19,47.34 4.19,45.53 QBE.3
N$40
  Top 0.254: X.3 19,25.2 18.25,24.45 CH340.8
N$51
  Top 0.254: D5.3 PCF8563.8 30.05,34.59 C5.1
RST
  Top 0.254: ESP.RST 35,56.5 34.9,56.6 34.8,56.5 R1.1
S1
  Top 0.813: QP1.3 QN1.3 38,15.4 40.05,13.35 40.05,6 JP2.2
S2
  Top 0.813: QP2.3 QN2.3 47,15.4 45.2,13.6 45.2,6 JP1.1
S3
  Top 0.813: QN3.3 QP3.3 52,15.4 50.25,13.65 JP1.2
SCL  (via drill 0.3)
  Top 0.203: 33.96,55.77 34,55.82 34,57.34 33.43,57.91 33.43,59.82 31.34,61.91 U$1.3 | 33.96,55.77 33.81,55.63 32.58,55.63 30.86,57.34 30.86,58.48 RCL.1 | v31.05,38.2 30,37.15 29.43,37.15 PCF8563.6 | 33.96,55.77 34.2,55.53 38.86,55.53 44.2,50.2 50.01,50.2 50.67,49.53 54.86,49.53 55.05,49.72 55.05,51.34 53.91,52.48 53.53,52.48 ESP.4
  Bottom 0.203: v31.05,38.2 31.05,61.72 31.24,61.91 U$1.3
SDA  (via drill 0.3)
  Top 0.203: U$1.4 33.81,61.91 34.29,61.44 34.29,58.58 RDA.1 34.38,58.48 35.24,57.63 38.77,57.63 45.81,50.58 53.44,50.58 ESP.5 | v33.34,42.39 29.43,38.48 PCF8563.5
  Bottom 0.203: v33.34,42.39 33.34,61.53 33.72,61.91 U$1.4
SENSE  (via drill 0.3)
  Top 0.508: v32,54.2 32.29,54.48 33.15,54.48 RA.2 | v36.01,20.48 36.01,19.62 36.96,18.67 QN1.2 | v44.86,17.43 46.01,18.57 QN2.2 | v27.81,17.24 27.65,17.24
  Top 0.813: RG.2 28.3,14.25 27.65,14.9 27.65,17.24 27.65,17.3 28.05,17.7 QNC.2
  Bottom 0.508: v32,54.2 32,24.48 v36.01,20.48 36.2,20.57 37.05,21.43 40.2,21.43 41.2,20.43 | v44.86,17.43 44.2,17.43 41.2,20.43 | v27.81,17.24 38.01,17.24 41.2,20.43
VCC  (via drill 0.3)
  Top 0.203: R1.2 33.15,56.58 32.67,57.05 32.67,58.48 RDA.2 32.58,58.58 32.29,58.58 31.53,59.34 29.15,59.34 | 29.15,59.34 29.15,61.53 28.77,61.91 U$1.2 | 29.15,59.34 29.15,58.58 RCL.2 | 31.91,52.48 33.15,52.48 R2.2 | 31.91,52.48 23.43,44.01 23.43,34.77 24.48,33.72 D5.2 24.57,33.62 v24.57,30.57 | v28.77,55.53 31.81,52.48 31.91,52.48 | RTC.2 28.19,27.05 29.05,27.91 30.48,27.91 30.77,27.62 30.77,24.29 30.57,24.1 28.57,24.1 28.19,23.72 28.19,20.57 RVC.2 28.1,20.48 27.62,20.48 v26.86,19.72 | v13.81,15.91 17.24,19.34 CH340.4 | v12.95,15.05 12.93,15.02 | 13.33,6.58 11.05,8.86 11.05,11.43 13.05,13.43 C3.2 | 56.2,23.72 56.2,20.57 RV3.2 | 56.2,23.72 56.58,24.1 58.58,24.1 58.77,24.29 58.77,27.53 58.39,27.91 57.05,27.91 56.2,27.05 RT3.2 | 39.62,24.1 37.53,24.1 37.15,23.72 37.15,20.57 RV1.2 | 39.62,24.1 39.81,24.29 39.81,26.38 | 39.81,26.38 39.81,27.53 39.43,27.91 39.24,27.91 | 39.24,27.91 38.1,27.91 37.24,27.05 RT1.2 | 45.96,23.57 43.81,25.72 43.81,26.19 43.62,26.38 39.81,26.38 | 45.96,23.57 46.1,23.43 46.1,20.57 RV2.2 | 48.2,27.91 48.39,27.91 48.77,27.53 48.77,24.29 48.39,23.91 46.29,23.91 45.96,23.57 | 48.2,27.91 47.24,27.91 46.39,27.05 46.2,27.05 RT2.2 | 39.24,27.91 39.24,37.34 37.53,39.05 37.53,42.39 ESP.VCC | 56.2,23.72 54.67,23.72 52.86,25.53 52.86,26.19 52.48,26.57 52.29,26.57 52.01,26.86 52.01,30.1 51.72,30.39 50.58,30.39 48.2,28 48.2,27.91 | v39.91,20.48 39.91,23.72 39.62,24 39.62,24.1
  Top 0.254: C3.2 13.15,14.8 12.93,15.02 12.4,15.55 CH340.16 | ESP.VCC 35,42.5 34.9,42.4 34.8,42.5 CE.1
  Top 0.61: 1117.4 9.7,3.9 10.65,3.9 13.33,6.58 13.75,7 16,7 C2.+ 16.3,7 17,7 17.5,7.5 22.2,7.5 23.15,6.55 R4.2
  Bottom 0.203: v28.77,55.53 28.77,61.91 U$1.2 | v12.95,15.05 v13.81,15.91 13.91,15.91 17.72,19.72 v26.86,19.72 31.81,19.72 | 31.81,19.72 39.15,19.72 v39.91,20.48 | v24.57,30.57 24.57,28.1 31.81,20.86 31.81,19.72
VIN
  Top 0.305: RPP.1 7.53,38.48 5.71,38.48 QPP.2 5.62,38.39 4.57,37.34 4.57,31.72 5.33,30.96 D1.A | 6.79,22.21 5.91,21.34 5.91,14.29 6,14.19 6,10.38 6.1,10.1
  Top 0.61: 1117.3 7.35,10.1 6.1,10.1 4.5,8.5 3.5,8.5 C1.+ | USB.VBUS 7.4,21.6 6.79,22.21 5.5,23.5 5.5,30.7 D1.A

### Text on the board
tNames: OSBeeWiFi 2.0 | bee.opensprinkler.com | Non-latch / Jumper | COM | S1 | S2 | S3
bNames: OpenSprinkler Bee (OSBee) | WiFi v2.0 with ESP8266 | bee.opensprinkler.com
BoxDim: Serpac WM-032C Enclosure | All units are in inch | Left | Right | Front | Bottom